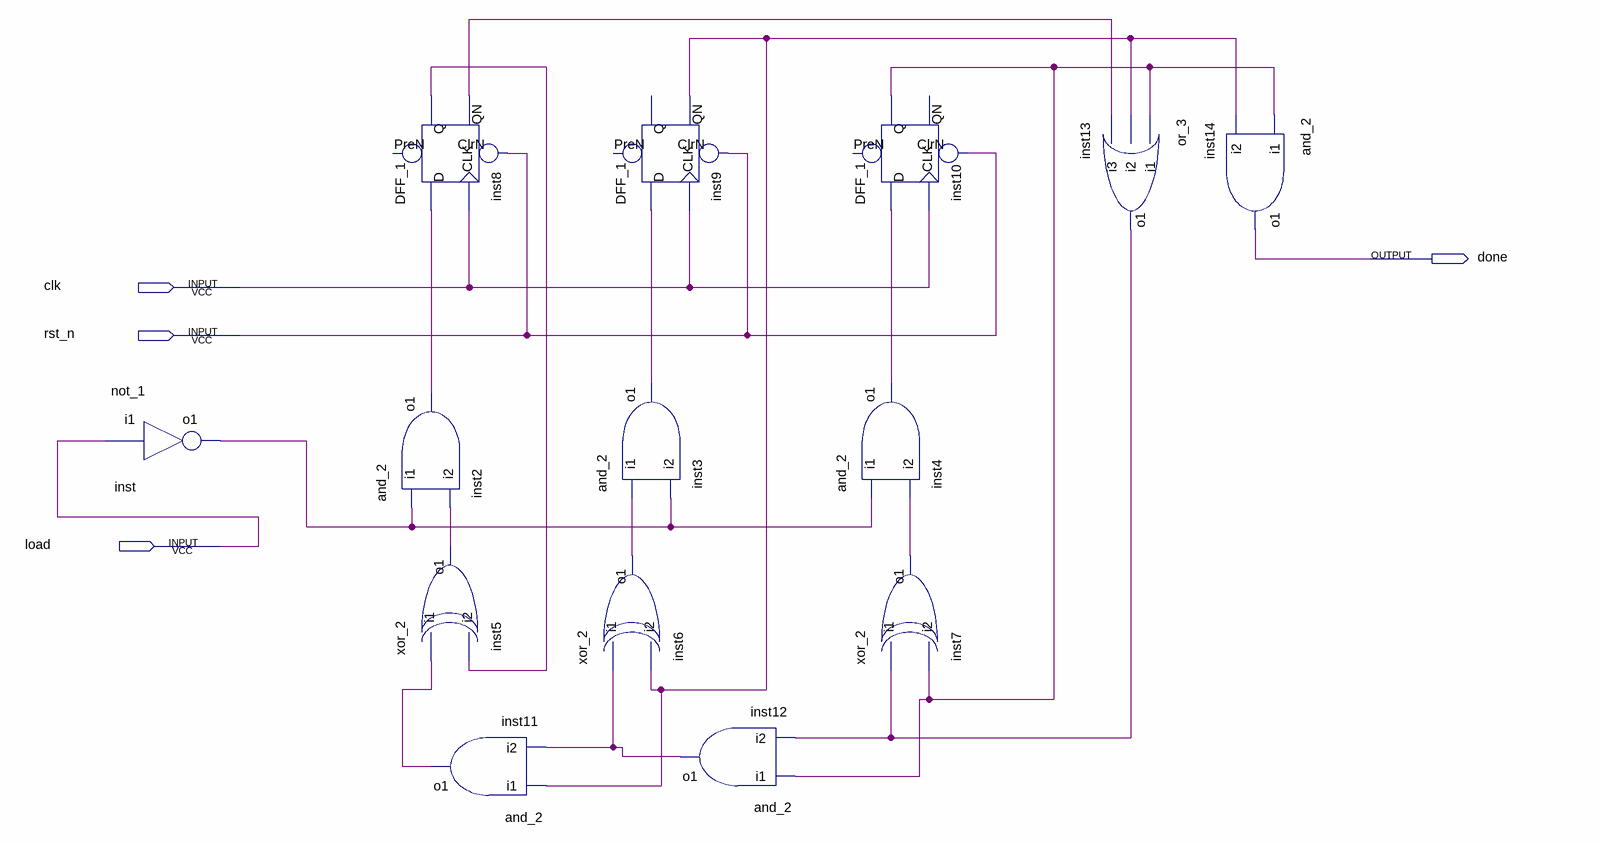
[diagram p0: schematic sheet]
// Quartus schematic FSM.bdf as structural Verilog: 14 symbols, 4 pins
module FSM (
  input  clk,
  input  rst_n,
  input  load,
  output done
);

  wire inst2_o1, inst3_o1, inst4_o1, inst5_o1, inst6_o1, inst7_o1, inst8_q, inst8_qn, inst9_qn, inst10_q,
       inst11_o1, inst12_o1, inst13_o1, inst_o1;

  not_1 inst (.i1(load), .o1(inst_o1));
  DFF_1 inst8 (.CLK(clk), .D(inst2_o1), .ClrN(rst_n), .QN(inst8_qn), .Q(inst8_q));  // open: PreN
  and_2 inst2 (.i1(inst_o1), .i2(inst5_o1), .o1(inst2_o1));
  xor_2 inst5 (.i1(inst11_o1), .i2(inst8_q), .o1(inst5_o1));
  and_2 inst11 (.i1(inst9_qn), .i2(inst12_o1), .o1(inst11_o1));
  xor_2 inst6 (.i1(inst12_o1), .i2(inst9_qn), .o1(inst6_o1));
  DFF_1 inst9 (.CLK(clk), .D(inst3_o1), .ClrN(rst_n), .QN(inst9_qn));  // open: PreN, Q
  and_2 inst3 (.i1(inst6_o1), .i2(inst_o1), .o1(inst3_o1));
  and_2 inst12 (.i1(inst10_q), .i2(inst13_o1), .o1(inst12_o1));
  DFF_1 inst10 (.CLK(clk), .D(inst4_o1), .ClrN(rst_n), .Q(inst10_q));  // open: PreN, QN
  and_2 inst4 (.i1(inst_o1), .i2(inst7_o1), .o1(inst4_o1));
  xor_2 inst7 (.i1(inst13_o1), .i2(inst10_q), .o1(inst7_o1));
  or_3 inst13 (.i1(inst10_q), .i2(inst9_qn), .i3(inst8_qn), .o1(inst13_o1));
  and_2 inst14 (.i1(inst10_q), .i2(inst9_qn), .o1(done));
endmodule
